# Altium project fmuvxX-baseT1.PrjPCB (part 2 of 2)

## Sheet 07_power_input.SchDoc: =Proj_Title
size B; Date: 05/11/2022; CheckedBy: David Sidrane; Author: Dugan Yoon; Organization: © 2022 NXP; Address1: Giesshuebelstrasse 40; Address2: 8045 Zurich, Switzerland; DocumentNumber: 725001; Revision: 01; SheetNumber: 7; SheetTotal: 11
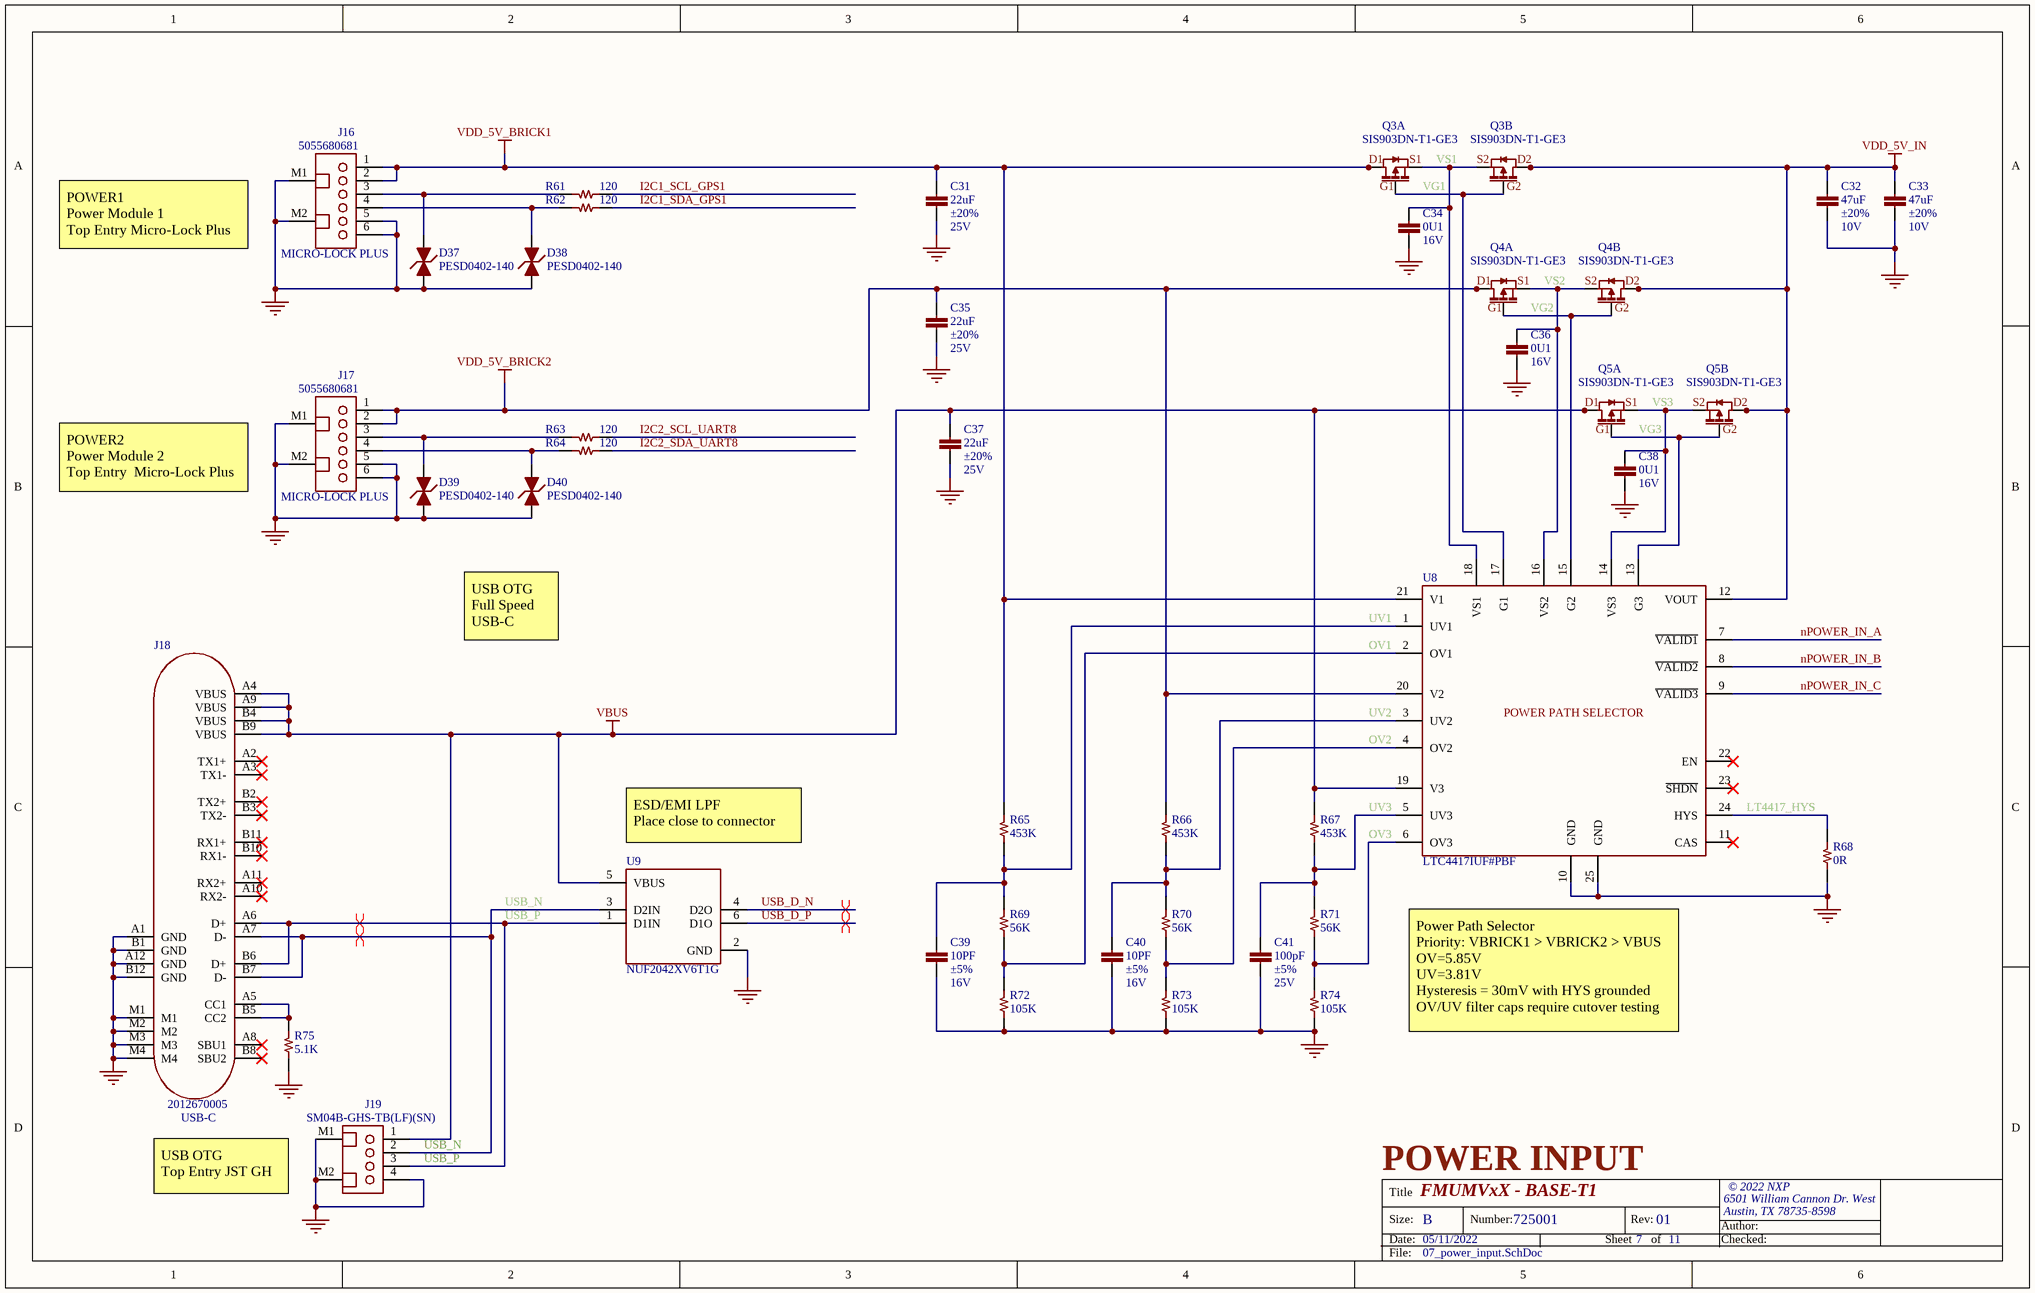
[diagram p2: 07_power_input.SchDoc]

### Parts
C31  value 22uF  Tolerance: ±20%  Voltage - Rated: 25V  [CAPC200X125X70L40N]  (hidden comment: CAP CER 22UF 20% 25V X5R 0805)
C32  value 47uF  Tolerance: ±20%  Voltage - Rated: 10V  [CAPC200X125X145L45N]  (hidden comment: CAP CER 47UF 20% 10V X5R 0805)
C33  value 47uF  Tolerance: ±20%  Voltage - Rated: 10V  [CAPC200X125X145L45N]  (hidden comment: CAP CER 47UF 20% 10V X5R 0805)
C34  value 0U1  Voltage - Rated: 16V  [CAPC100X50X56L25N]  (hidden comment: CAP CER 0.1UF 10% 16V X7R 0402)
C35  value 22uF  Tolerance: ±20%  Voltage - Rated: 25V  [CAPC200X125X70L40N]  (hidden comment: CAP CER 22UF 20% 25V X5R 0805)
C36  value 0U1  Voltage - Rated: 16V  [CAPC100X50X56L25N]  (hidden comment: CAP CER 0.1UF 10% 16V X7R 0402)
C37  value 22uF  Tolerance: ±20%  Voltage - Rated: 25V  [CAPC200X125X70L40N]  (hidden comment: CAP CER 22UF 20% 25V X5R 0805)
C38  value 0U1  Voltage - Rated: 16V  [CAPC100X50X56L25N]  (hidden comment: CAP CER 0.1UF 10% 16V X7R 0402)
C39  value 10PF  Tolerance: ±5%  Voltage - Rated: 16V  [CAPC100X50X56L25N]  (hidden comment: CAP CER 10PF 5% 16V C0G/NP0 0402)
C40  value 10PF  Tolerance: ±5%  Voltage - Rated: 16V  [CAPC100X50X56L25N]  (hidden comment: CAP CER 10PF 5% 16V C0G/NP0 0402)
C41  value 100pF  Tolerance: ±5%  Voltage - Rated: 25V  [CAPC100X50X56L25N]  (hidden comment: CAP CER 100PF 5% 25V COG/NPO 0402)
D37  Manufacturer Part Number: PESD0402-140  [DIONC100X50X43L20N]  (hidden comment: DIODE TVS BIDIRECTIONAL 14VWM 40VC 0402)
D38  Manufacturer Part Number: PESD0402-140  [DIONC100X50X43L20N]  (hidden comment: DIODE TVS BIDIRECTIONAL 14VWM 40VC 0402)
D39  Manufacturer Part Number: PESD0402-140  [DIONC100X50X43L20N]  (hidden comment: DIODE TVS BIDIRECTIONAL 14VWM 40VC 0402)
D40  Manufacturer Part Number: PESD0402-140  [DIONC100X50X43L20N]  (hidden comment: DIODE TVS BIDIRECTIONAL 14VWM 40VC 0402)
J16  ID: MICRO-LOCK PLUS  Manufacturer Part Number: 5055680681  [MOLEX_505568-0681]  (hidden comment: CONN HEADER MICRO-LOCK PLUS TOP 6POS 1.25MM SMT)
J17  ID: MICRO-LOCK PLUS  Manufacturer Part Number: 5055680681  [MOLEX_505568-0681]  (hidden comment: CONN HEADER MICRO-LOCK PLUS TOP 6POS 1.25MM SMT)
J18  ID: USB-C  Manufacturer Part Number: 2012670005  [MOLEX_2012670005]  (hidden comment: CONN RCPT USB C 3.1 SMT R/A SMD)
J19  Manufacturer Part Number: SM04B-GHS-TB(LF)(SN)  [JST_SM04B-GHS-TBLFSN]  (hidden comment: CONN HEADER GH SIDE 4POS 1.25MM SMT)
Q3  Manufacturer Part Number: SIS903DN-T1-GE3  [VISHAY_POWERPAK_1212-8_DUAL]  (hidden comment: TRAN MOSFET 2P-CH 20V 6A PowerPAK)  (parts A,B of 2)
Q4  Manufacturer Part Number: SIS903DN-T1-GE3  [VISHAY_POWERPAK_1212-8_DUAL]  (hidden comment: TRAN MOSFET 2P-CH 20V 6A PowerPAK)  (parts A,B of 2)
Q5  Manufacturer Part Number: SIS903DN-T1-GE3  [VISHAY_POWERPAK_1212-8_DUAL]  (hidden comment: TRAN MOSFET 2P-CH 20V 6A PowerPAK)  (parts A,B of 2)
R61  value 120  [RESC100X50X40L25]  (hidden comment: RES SMD 120 OHM 1% 1/16W 0402)
R62  value 120  [RESC100X50X40L25]  (hidden comment: RES SMD 120 OHM 1% 1/16W 0402)
R63  value 120  [RESC100X50X40L25]  (hidden comment: RES SMD 120 OHM 1% 1/16W 0402)
R64  value 120  [RESC100X50X40L25]  (hidden comment: RES SMD 120 OHM 1% 1/16W 0402)
R65  value 453K  [RESC100X50X40L25]  (hidden comment: RES SMD 453K OHM 1% 1/16W 0402)
R66  value 453K  [RESC100X50X40L25]  (hidden comment: RES SMD 453K OHM 1% 1/16W 0402)
R67  value 453K  [RESC100X50X40L25]  (hidden comment: RES SMD 453K OHM 1% 1/16W 0402)
R68  value 0R  [RESC100X50X40L25]  (hidden comment: RES SMD 0 OHM 1% 1/16W 0402)
R69  value 56K  [RESC100X50X40L25]  (hidden comment: RES SMD 56K OHM 1% 1/16W 0402)
R70  value 56K  [RESC100X50X40L25]  (hidden comment: RES SMD 56K OHM 1% 1/16W 0402)
R71  value 56K  [RESC100X50X40L25]  (hidden comment: RES SMD 56K OHM 1% 1/16W 0402)
R72  value 105K  [RESC100X50X40L25]  (hidden comment: RES SMD 105K OHM 1% 1/16W 0402)
R73  value 105K  [RESC100X50X40L25]  (hidden comment: RES SMD 105K OHM 1% 1/16W 0402)
R74  value 105K  [RESC100X50X40L25]  (hidden comment: RES SMD 105K OHM 1% 1/16W 0402)
R75  value 5.1K  [RESC100X50X40L25]  (hidden comment: RES SMD 5.1K OHM 1% 1/16W 0402)
U8  Manufacturer Part Number: LTC4417IUF#PBF  [QFN25P50_400X400X80L40X25T245N]  (hidden comment: IC OR CTRLR SRC SELECT 24QFN)
U9  Manufacturer Part Number: NUF2042XV6T1G  [SOFL6P50_160X160X60L20X22]  (hidden comment: IC FILTER RC(PI) 22 OHM/42PF SOT-563)

### Nets
GND: C31.2 C32.2 C33.2 C34.2 C35.2 C36.2 C37.2 C38.2 C39.2 C40.2 C41.2 D37.1 D38.1 D39.1 D40.1 J16.5 J16.6 J16.M1 J16.M2 J17.5 J17.6 J17.M1 J17.M2 J18.A1(GND) J18.A12(GND) J18.B1(GND) J18.B12(GND) J18.M1 J18.M2 J18.M3 J18.M4 J19.4 J19.M1 J19.M2 R68.2 R72.2 R73.2 R74.2 R75.2 U8.10(GND) U8.25(GND) U9.2(GND)
VBUS: C37.1 J18.A4(VBUS) J18.A9(VBUS) J18.B4(VBUS) J18.B9(VBUS) J19.1 Q5.7(D1) Q5.8(D1) R67.1 U8.19(V3) U9.5(VBUS)
VDD_5V_BRICK1: C31.1 J16.1 J16.2 Q3.7(D1) Q3.8(D1) R65.1 U8.21(V1)
VDD_5V_BRICK2: C35.1 J17.1 J17.2 Q4.7(D1) Q4.8(D1) R66.1 U8.20(V2)
VDD_5V_IN: C32.1 C33.1 Q3.5(D2) Q3.6(D2) Q4.5(D2) Q4.6(D2) Q5.5(D2) Q5.6(D2) U8.12(VOUT)
I2C1_SCL_GPS1: R61.2
I2C1_SDA_GPS1: R62.2
I2C2_SCL_UART8: R63.2
I2C2_SDA_UART8: R64.2
LT4417_HYS: R68.1 U8.24(HYS)
nPOWER_IN_A: U8.7(~{VALID1})
nPOWER_IN_B: U8.8(~{VALID2})
nPOWER_IN_C: U8.9(~{VALID3})
OV1: R69.2 R72.1 U8.2(OV1)
OV2: R70.2 R73.1 U8.4(OV2)
OV3: R71.2 R74.1 U8.6(OV3)
USB_D_N: U9.4(D2O)
USB_D_P: U9.6(D1O)
USB_N: J18.A7(D-) J18.B7(D-) J19.2 U9.3(D2IN)
USB_P: J18.A6(D+) J18.B6(D+) J19.3 U9.1(D1IN)
UV1: C39.1 R65.2 R69.1 U8.1(UV1)
UV2: C40.1 R66.2 R70.1 U8.3(UV2)
UV3: C41.1 R67.2 R71.1 U8.5(UV3)
VG1: Q3.2(G1) Q3.4(G2) U8.17(G1)
VG2: Q4.2(G1) Q4.4(G2) U8.15(G2)
VG3: Q5.2(G1) Q5.4(G2) U8.13(G3)
VS1: C34.1 Q3.1(S1) Q3.3(S2) U8.18(VS1)
VS2: C36.1 Q4.1(S1) Q4.3(S2) U8.16(VS2)
VS3: C38.1 Q5.1(S1) Q5.3(S2) U8.14(VS3)
NetD37_2: D37.2 J16.3 R61.1
NetD38_2: D38.2 J16.4 R62.1
NetD39_2: D39.2 J17.3 R63.1
NetD40_2: D40.2 J17.4 R64.1
NetJ18_A5: J18.A5(CC1) J18.B5(CC2) R75.1

Not connected (* = marked no-connect by the designer): J18 A2(TX1+)* A3(TX1-)* A8(SBU1)* A10(RX2-)* A11(RX2+)* B2(TX2+)* B3(TX2-)* B8(SBU2)* B10(RX1-)* B11(RX1+)*; U8 11(CAS)* 22(EN)* 23(~{SHDN})*

### Layout directives
differential pair: USB_D_N, USB_D_P, USB_N, USB_P

### Notes on the sheet
- POWER1
  Power Module 1
  Top Entry Micro-Lock Plus
- POWER2
  Power Module 2
  Top Entry  Micro-Lock Plus
- USB OTG
  Full Speed
  USB-C
- (near U9) ESD/EMI LPF
  Place close to connector
- (near U8) Power Path Selector
  Priority: VBRICK1 > VBRICK2 > VBUS
  OV=5.85V
  UV=3.81V
  Hysteresis = 30mV with HYS grounded
  OV/UV filter caps require cutover testing
- POWER INPUT
- USB OTG
  Top Entry JST GH
- Title
- Size:
- Date:
- B
- Number:
- Sheet
- Rev:
- of
- Author:
- Checked:
- File:
- (in symbol IC_LTC4417) POWER PATH SELECTOR

### Library data of the parts
C31 C35 C37 = CAP_22UF_20%_25V_X5R_0805: Manufacturer: Murata Electronics; Manufacturer Part Number: GRT21BR61E226ME13L; Packaging: Cut Tape (CT); Part Status: Active; Operating Temperature: -55°C ~ 125°C; Supplier 1: Digi-Key; Supplier Part Number 1: 490-12389-1-ND; Category: Capacitors; Stock 1: 0; Pricing 1: 1=0.58 (USD); ComponentLink1Description: https://www.digikey.com/en/products/detail/murata-electronics/GRT21BR61E226ME13L/5416811; ComponentLink1URL: https://www.digikey.com/en/products/detail/murata-electronics/GRT21BR61E226ME13L/5416811
C32 C33 = CAP_47UF_20%_10V_X5R_0805: Manufacturer: Murata Electronics North America; Manufacturer Part Number: GRM21BR61A476ME15L; Packaging: Cut Tape (CT); Part Status: Active; Operating Temperature: -55°C ~ 85°C; Supplier 1: Digi-Key; Supplier Part Number 1: 490-9961-1-ND; Category: Capacitors; Stock 1: 4315932; Pricing 1: 1=0.75 (USD); ComponentLink1Description: https://www.digikey.com/product-detail/en/murata-electronics-north-america/GRM21BR61A476ME15L/490-9961-1-ND/5026442; ComponentLink1URL: https://www.digikey.com/product-detail/en/murata-electronics-north-america/GRM21BR61A476ME15L/490-9961-1-ND/5026442
C34 C36 C38 = CAP_0U1_16V_X7R_0402: Manufacturer: Murata Electronics; Manufacturer Part Number: GCM155R71C104KA55J; Packaging: Cut Tape (CT); Part Status: Active; Tolerance: ±10%; Operating Temperature: -55°C ~ 125°C; Supplier 1: Digi-Key; Supplier Part Number 1: 490-7998-1-ND; Category: Capacitors; Stock 1: 6381653; Pricing 1: 1=0.1, 10=0.049, 100=0.022, 500=0.0157, 1000=0.01233, 2500=0.01121, 5000=0.01032 (USD); ComponentLink1Description: https://www.digikey.com/product-detail/en/murata-electronics/GCM155R71C104KA55J/490-7998-1-ND/4380283; ComponentLink1URL: https://www.digikey.com/product-detail/en/murata-electronics/GCM155R71C104KA55J/490-7998-1-ND/4380283
C39 C40 = CAP_10PF_5%_16V_NPO_0402: Manufacturer: Wurth Electronics Inc.; Manufacturer Part Number: 885012005025; Temperature Coefficient: C0G, NP0; Packaging: Cut Tape (CT); Part Status: Active; Operating Temperature: -55°C ~ 125°C; Supplier 1: Digi-Key; Supplier Part Number 1: 732-7441-1-ND; Category: Capacitors; Stock 1: 79611; Pricing 1: 1=0.1, 10=0.032, 100=0.0143, 500=0.0102, 1000=0.00802, 2500=0.00729, 5000=0.0067 (USD); ComponentLink1Description: https://www.digikey.com/product-detail/en/wurth-electronics-inc/885012005025/732-7441-1-ND/5454068; ComponentLink1URL: https://www.digikey.com/product-detail/en/wurth-electronics-inc/885012005025/732-7441-1-ND/5454068
C41 = CAP_100PF_5%_25V_NPO_0402: Manufacturer: KEMET; Manufacturer Part Number: C0402C101J3GACTU; Packaging: Cut Tape (CT); Part Status: Active; Operating Temperature: -55°C ~ 125°C; Supplier 1: Digi-Key; Supplier Part Number 1: 399-1022-1-ND; Category: Capacitors; Stock 1: 300; Pricing 1: 1=0.1, 10=0.02, 100=0.0091, 500=0.0065, 1000=0.00511, 2500=0.00465, 5000=0.00428 (USD); ComponentLink1Description: https://www.digikey.com/product-detail/en/kemet/C0402C101J3GACTU/399-1022-1-ND/411297; ComponentLink1URL: https://www.digikey.com/product-detail/en/kemet/C0402C101J3GACTU/399-1022-1-ND/411297
D37-D40 = DIODE_TVS_0402: Manufacturer: Littelfuse Inc.; Packaging: Cut Tape (CT); Part Status: Active; Operating Temperature: -55°C ~ 125°C (TJ); ComponentLink1URL: https://www.digikey.com/products/en/circuit-protection/tvs-diodes/144?k=PESD0402-140&k=&pkeyword=PESD0402-140&pv7=2&sf=0&quantity=&ColumnSort=0&page=1&pageSize=25; ComponentLink1Description: https://www.digikey.com/products/en/circuit-protection/tvs-diodes/144?k=PESD0402-140&k=&pkeyword=PESD0402-140&pv7=2&sf=0&quantity=&ColumnSort=0&page=1&pageSize=25; Supplier 1: Digi-Key; Supplier Part Number 1: PESD0402-140CT-ND; Category: Circuit Protection; Stock 1: 281442; Pricing 1: 10000=0.13154, 30000=0.12096 (USD)
J16 J17 = CONN_HDR_1X6_RCPT_1.25MM_VERT_SMT: Manufacturer: Molex, LLC; Voltage - Rated: 50V; System: Connector; Packaging: Cut Tape (CT); Part Status: Active; Operating Temperature: -40°C ~ 105°C; Supplier 1: Digi-Key; Supplier Part Number 1: WM26835CT-ND; Category: Connectors, Interconnects; Stock 1: 4793; Pricing 1: 1=1.05 (USD); ComponentLink1Description: https://www.digikey.com/products/en/connectors-interconnects/rectangular-connectors-headers-male-pins/314?k=5055680681&k=&pkeyword=5055680681&sv=0&pv7=2&sf=0&quantity=&ColumnSort=0&page=1&pageSize=25; ComponentLink1URL: https://www.digikey.com/products/en/connectors-interconnects/rectangular-connectors-headers-male-pins/314?k=5055680681&k=&pkeyword=5055680681&sv=0&pv7=2&sf=0&quantity=&ColumnSort=0&page=1&pageSize=25
J18 = CONN_RCPT_24POS_USB-C_RA-3_SMD: Manufacturer: Molex, LLC; Voltage - Rated: 30VAC/DC; System: Connector; Packaging: Cut Tape (CT); Part Status: Active; Operating Temperature: -40°C ~ 105°C; Supplier 1: Digi-Key; Supplier Part Number 1: WM17992CT-ND; Category: Connectors, Interconnects; Stock 1: 58789; Pricing 1: 1=2.58 (USD); ComponentLink1Description: https://www.digikey.com/product-detail/en/molex/2012670005/WM17992CT-ND/8593492; ComponentLink1URL: https://www.digikey.com/product-detail/en/molex/2012670005/WM17992CT-ND/8593492
J19 = CONN_JST_GH_4PIN_RA_SMT: Manufacturer: JST Sales America Inc.; Voltage Rating: 50V; System: Connector; Packaging: Cut Tape (CT); Part Status: Active; Operating Temperature: -25°C ~ 85°C; Supplier 1: Digi-Key; Supplier Part Number 1: 455-1566-1-ND; Category: Connectors, Interconnects; Stock 1: 109892; Pricing 1: 1=0.45, 10=0.423, 100=0.3244, 500=0.28212, 1000=0.23274 (USD); ComponentLink1Description: https://www.digikey.com/products/en/connectors-interconnects/rectangular-connectors-headers-male-pins/314?k=SM04B-GHS-TB%28LF%29%28SN%29-&k=&pkeyword=SM04B-GHS-TB%28LF%29%28SN%29-&pv7=2&sf=0&quantity=&ColumnSort=0&page=1&pageSize=25; ComponentLink1URL: https://www.digikey.com/products/en/connectors-interconnects/rectangular-connectors-headers-male-pins/314?k=SM04B-GHS-TB%28LF%29%28SN%29-&k=&pkeyword=SM04B-GHS-TB%28LF%29%28SN%29-&pv7=2&sf=0&quantity=&ColumnSort=0&page=1&pageSize=25
Q3-Q5 = TRAN_MOSFET_DUAL_PCHANNEL_PowerPAK: Manufacturer: Vishay Siliconix; RoHS: RoHS Compliant; Packaging: Cut Tape (CT); Part Status: Active; Drain to Source Voltage (Vdss): 20V; Current - Continuous Drain (Id) @ 25°C: 6A; Operating Temperature: -55°C ~ 150°C (TJ); Supplier 1: Digi-Key; Supplier Part Number 1: SIS903DN-T1-GE3CT-ND; Category: Discrete Semiconductor Products; Stock 1: 0; Pricing 1: 1=1.01 (USD); ComponentLink1Description: https://www.digikey.com/products/en/discrete-semiconductor-products/transistors-fets-mosfets-arrays/289?k=sis903dn&k=&pkeyword=sis903dn&sv=0&pv7=2&sf=0&quantity=&ColumnSort=0&page=1&pageSize=25; ComponentLink1URL: https://www.digikey.com/products/en/discrete-semiconductor-products/transistors-fets-mosfets-arrays/289?k=sis903dn&k=&pkeyword=sis903dn&sv=0&pv7=2&sf=0&quantity=&ColumnSort=0&page=1&pageSize=25
R61-R64 = RES_120_1%_1/16W_0402: Manufacturer: Yageo; Manufacturer Part Number: RC0402FR-07120RL; Category: Resistors; Packaging: Cut Tape (CT); Part Status: Active; Tolerance: ±1%; Operating Temperature: -55°C ~ 155°C; Supplier 1: Digi-Key; Supplier Part Number 1: 311-120LRCT-ND; Stock 1: 607269; Pricing 1: 1=0.1, 10=0.014, 100=0.0056, 1000=0.00253, 2500=0.0022, 5000=0.00181 (USD); Power: 1/16W; ComponentLink1Description: https://www.digikey.com/products/en/resistors/chip-resistor-surface-mount/52?k=RC0402FR-07120RL&k=&pkeyword=RC0402FR-07120RL&pv7=2&sf=0&quantity=&ColumnSort=0&page=1&pageSize=25; ComponentLink1URL: https://www.digikey.com/products/en/resistors/chip-resistor-surface-mount/52?k=RC0402FR-07120RL&k=&pkeyword=RC0402FR-07120RL&pv7=2&sf=0&quantity=&ColumnSort=0&page=1&pageSize=25
R65-R67 = RES_453K_1%_1/16W_0402: Manufacturer: Yageo; Manufacturer Part Number: RC0402FR-07453KL; Packaging: Cut Tape (CT); Part Status: Active; Tolerance: ±1%; Operating Temperature: -55°C ~ 155°C; Supplier 1: Digi-Key; Supplier Part Number 1: YAG3164CT-ND; Category: Resistors; Stock 1: 1103957; Pricing 1: 1=0.1, 10=0.014, 100=0.0056, 1000=0.00253, 2500=0.0022, 5000=0.00181 (USD); Power: 1/16W; ComponentLink1Description: https://www.digikey.com/products/en/resistors/chip-resistor-surface-mount/52?k=&pkeyword=&pv2085=u453+kOhms&pv2=1&sf=0&FV=fffc000d%2C1c0002%2C1f140000%2Cffe00034%2Cc0001%2C2b80016&quantity=&ColumnSort=0&page=1&pageSize=25; ComponentLink1URL: https://www.digikey.com/products/en/resistors/chip-resistor-surface-mount/52?k=&pkeyword=&pv2085=u453+kOhms&pv2=1&sf=0&FV=fffc000d%2C1c0002%2C1f140000%2Cffe00034%2Cc0001%2C2b80016&quantity=&ColumnSort=0&page=1&pageSize=25
R68 = RES_0R_1%_1/16W_0402: Manufacturer: Yageo; Manufacturer Part Number: RC0402JR-070RL; Packaging: Cut Tape (CT); Part Status: Active; Tolerance: ±1%; Operating Temperature: -55°C ~ 155°C; Supplier 1: Digi-Key; Supplier Part Number 1: 311-0.0JRCT-ND; Category: Resistors; Stock 1: 34962204; Pricing 1: 1=0.1, 10=0.014, 100=0.0056, 1000=0.00253, 2500=0.0022, 5000=0.00181 (USD); Power: 1/16W; ComponentLink1Description: https://www.digikey.com/product-detail/en/yageo/RC0402JR-070RL/311-0.0JRCT-ND/729353; ComponentLink1URL: https://www.digikey.com/product-detail/en/yageo/RC0402JR-070RL/311-0.0JRCT-ND/729353
R69-R71 = RES_56K_1%_1/16W_0402: Manufacturer: Yageo; Manufacturer Part Number: AC0402FR-0756KL; Packaging: Cut Tape (CT); Part Status: Active; Tolerance: ±1%; Operating Temperature: -55°C ~ 155°C; Supplier 1: Digi-Key; Supplier Part Number 1: YAG3501CT-ND; Category: Resistors; Stock 1: 261; Pricing 1: 1=0.1, 10=0.014, 100=0.0056, 1000=0.00253, 2500=0.0022, 5000=0.00181 (USD); Power: 1/16W; ComponentLink1Description: https://www.digikey.com/product-detail/en/yageo/AC0402FR-0756KL/YAG3501CT-ND/6006350; ComponentLink1URL: https://www.digikey.com/product-detail/en/yageo/AC0402FR-0756KL/YAG3501CT-ND/6006350
R72-R74 = RES_105K_1%_1/16W_0402: Manufacturer: Yageo; Manufacturer Part Number: RC0402FR-07105KL; Packaging: Cut Tape (CT); Part Status: Active; Tolerance: ±1%; Operating Temperature: -55°C ~ 155°C; Supplier 1: Digi-Key; Supplier Part Number 1: YAG2946CT-ND; Category: Resistors; Stock 1: 1079008; Pricing 1: 1=0.1, 10=0.014, 100=0.0056, 1000=0.00253, 2500=0.0022, 5000=0.00181 (USD); Power: 1/16W; ComponentLink1Description: https://www.digikey.com/product-detail/en/yageo/RC0402FR-07105KL/YAG2946CT-ND/5281811; ComponentLink1URL: https://www.digikey.com/product-detail/en/yageo/RC0402FR-07105KL/YAG2946CT-ND/5281811
R75 = RES_5.1K_1%_1/16W_0402: Manufacturer: Yageo; Manufacturer Part Number: RC0402FR-075K1L; Packaging: Cut Tape (CT); Part Status: Active; Tolerance: ±1%; Operating Temperature: -55°C ~ 155°C; Supplier 1: Digi-Key; Supplier Part Number 1: 311-5.10KLRCT-ND; Category: Resistors; Stock 1: 4559073; Pricing 1: 1=0.1, 10=0.014, 100=0.0056, 1000=0.00253, 2500=0.0022, 5000=0.00181 (USD); Power: 1/16W; ComponentLink1Description: https://www.digikey.com/product-detail/en/yageo/RC0402FR-075K1L/311-5.10KLRCT-ND/729571; ComponentLink1URL: https://www.digikey.com/product-detail/en/yageo/RC0402FR-075K1L/311-5.10KLRCT-ND/729571
U8 = IC_LTC4417: Manufacturer: Linear Technology/Analog Devices; FET Type: P-Channel; Ratio - Input:Output: 3:1; Current - Supply: 28µA; Voltage - Supply: 2.5 V ~ 36 V; RoHS: RoHS Compliant; Packaging: Tube; Part Status: Active; Type: Source Selector Switch; Current - Output (Max): -; Applications: Battery Backup, Handheld/Mobile Devices; Operating Temperature: -40°C ~ 85°C; Mounting Type: Surface Mount; Package / Case: 24-WFQFN Exposed Pad; Supplier Device Package: 24-QFN (4x4); Supplier 1: Digi-Key; Supplier Part Number 1: LTC4417IUF#PBF-ND; Category: Integrated Circuits (ICs); Stock 1: 7448; Pricing 1: 1=8.73 (USD); ComponentLink1Description: https://www.digikey.com/product-detail/en/linear-technology-analog-devices/LTC4417IUF-PBF/LTC4417IUF-PBF-ND/3838535; ComponentLink1URL: https://www.digikey.com/product-detail/en/linear-technology-analog-devices/LTC4417IUF-PBF/LTC4417IUF-PBF-ND/3838535
U9 = IC_NUF2042XV6_SOT563: Manufacturer: ON Semiconductor; Packaging: Cut Tape (CT); Part Status: Active; Operating Temperature: -55°C ~ 125°C; Voltage - Rated: -; ComponentLink1URL: https://www.digikey.com/products/en/filters/emi-rfi-filters-lc-rc-networks/835?k=nuf2042xv6&k=&pkeyword=nuf2042xv6&pv7=2&pv1989=0&sf=0&quantity=&ColumnSort=0&page=1&pageSize=25; ComponentLink1Description: https://www.digikey.com/products/en/filters/emi-rfi-filters-lc-rc-networks/835?k=nuf2042xv6&k=&pkeyword=nuf2042xv6&pv7=2&pv1989=0&sf=0&quantity=&ColumnSort=0&page=1&pageSize=25; Supplier 1: Digi-Key; Supplier Part Number 1: NUF2042XV6T1GOSCT-ND; Category: Filters; Stock 1: 4900; Pricing 1: 1=0.31, 10=0.286, 25=0.2728, 50=0.264, 100=0.2552, 250=0.242, 500=0.2024, 1000=0.15708 (USD)

## Sheet 11_sensors.SchDoc: =Proj_Title
size B; Date: 05/11/2022; CheckedBy: David Sidrane; Author: Dugan Yoon; Organization: © 2022 NXP; Address1: Giesshuebelstrasse 40; Address2: 8045 Zurich, Switzerland; DocumentNumber: 725001; Revision: 01; SheetNumber: 11; SheetTotal: 11
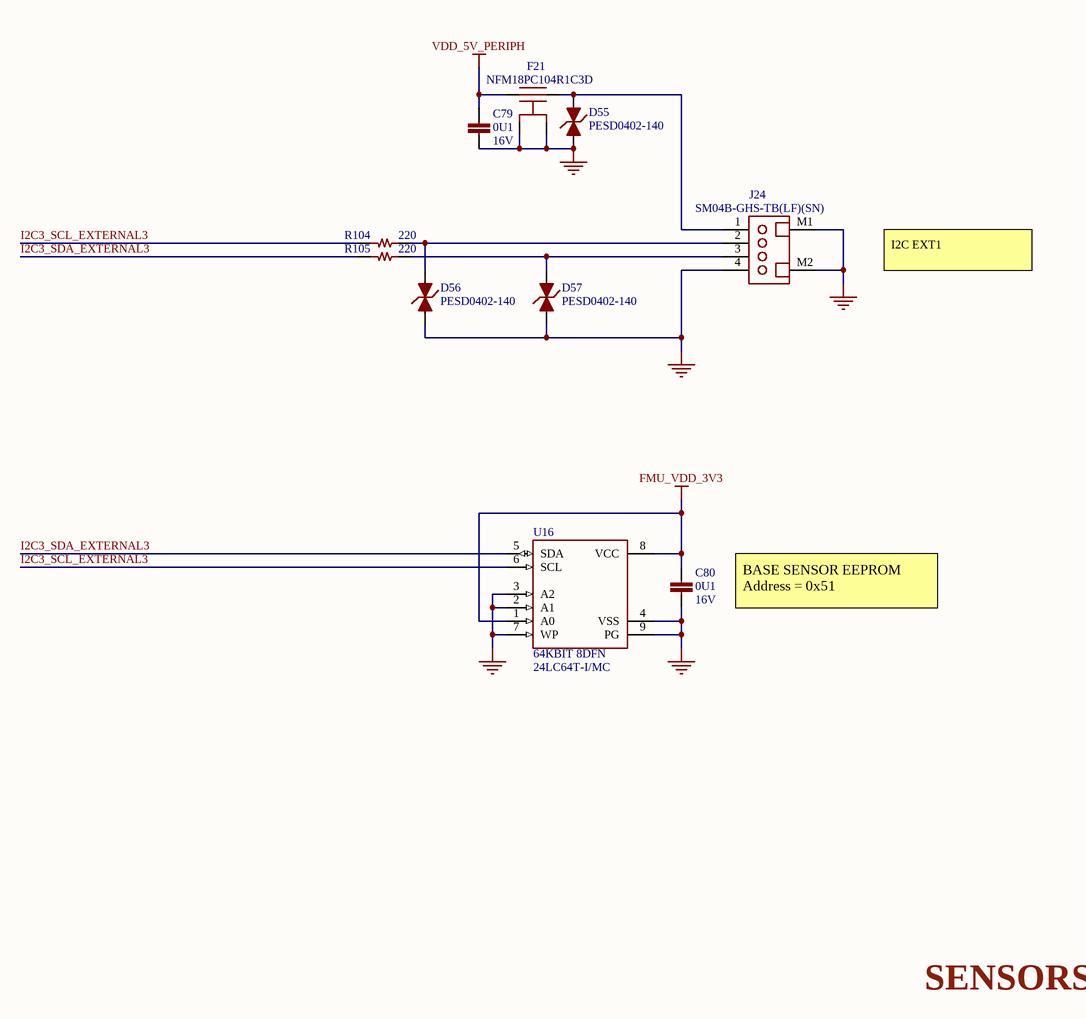
[diagram p3: 11_sensors.SchDoc]

### Parts
C79  value 0U1  Voltage - Rated: 16V  [CAPC100X50X56L25N]  (hidden comment: CAP CER 0.1UF 10% 16V X7R 0402)
C80  value 0U1  Voltage - Rated: 16V  [CAPC100X50X56L25N]  (hidden comment: CAP CER 0.1UF 10% 16V X7R 0402)
D55  Manufacturer Part Number: PESD0402-140  [DIONC100X50X43L20N]  (hidden comment: DIODE TVS BIDIRECTIONAL 14VWM 40VC 0402)
D56  Manufacturer Part Number: PESD0402-140  [DIONC100X50X43L20N]  (hidden comment: DIODE TVS BIDIRECTIONAL 14VWM 40VC 0402)
D57  Manufacturer Part Number: PESD0402-140  [DIONC100X50X43L20N]  (hidden comment: DIODE TVS BIDIRECTIONAL 14VWM 40VC 0402)
F21  Manufacturer Part Number: NFM18PC104R1C3D  [NFM18PC104R1C3_0603_NO_VIA]  (hidden comment: FILTER CAP FEEDTHRU 0.1UF 20% 16V 0603)
J24  Manufacturer Part Number: SM04B-GHS-TB(LF)(SN)  [JST_SM04B-GHS-TBLFSN]  (hidden comment: CONN HEADER GH SIDE 4POS 1.25MM SMT)
R104  value 220  [RESC100X50X40L25]  (hidden comment: RES SMD 220 OHM 1% 1/16W 0402)
R105  value 220  [RESC100X50X40L25]  (hidden comment: RES SMD 220 OHM 1% 1/16W 0402)
U16  ID: 64KBIT 8DFN  Manufacturer Part Number: 24LC64T-I/MC  [SON9P50_200X300X100L40X25T153X170N]  (hidden comment: IC EEPROM 64K I2C 400KHZ 8DFN)

### Nets
FMU_VDD_3V3: C80.1 U16.1(A0) U16.8(VCC)
GND: C79.2 C80.2 D55.1 D56.1 D57.1 F21.2A(GND) F21.2B(GND) J24.4 J24.M1 J24.M2 U16.2(A1) U16.3(A2) U16.4(VSS) U16.7(WP) U16.9(PG)
VDD_5V_PERIPH: C79.1 F21.1
I2C3_SCL_EXTERNAL3: R104.1 U16.6(SCL)
I2C3_SDA_EXTERNAL3: R105.1 U16.5(SDA)
NetD55_2: D55.2 F21.3 J24.1
NetD56_2: D56.2 J24.2 R104.2
NetD57_2: D57.2 J24.3 R105.2

### Notes on the sheet
- I2C EXT1
- BASE SENSOR EEPROM
  Address = 0x51
- SENSORS
- Title
- Size:
- Date:
- B
- Number:
- Sheet
- Rev:
- of
- Author:
- Checked:
- File:

### Library data of the parts
C79 C80 = CAP_0U1_16V_X7R_0402: as C34 on sheet 07_power_input; Packaging: Cut Tape (CT); Part Status: Active; Tolerance: ±10%; Operating Temperature: -55°C ~ 125°C; Supplier 1: Digi-Key; Supplier Part Number 1: 490-7998-1-ND; Category: Capacitors; Stock 1: 6381653; Pricing 1: 1=0.1, 10=0.049, 100=0.022, 500=0.0157, 1000=0.01233, 2500=0.01121, 5000=0.01032 (USD); ComponentLink1Description: https://www.digikey.com/product-detail/en/murata-electronics/GCM155R71C104KA55J/490-7998-1-ND/4380283; ComponentLink1URL: https://www.digikey.com/product-detail/en/murata-electronics/GCM155R71C104KA55J/490-7998-1-ND/4380283
D55-D57 = DIODE_TVS_0402: Manufacturer: Littelfuse Inc.; Packaging: Cut Tape (CT); Part Status: Active; Operating Temperature: -55°C ~ 125°C (TJ); ComponentLink1URL: https://www.digikey.com/products/en/circuit-protection/tvs-diodes/144?k=PESD0402-140&k=&pkeyword=PESD0402-140&pv7=2&sf=0&quantity=&ColumnSort=0&page=1&pageSize=25; ComponentLink1Description: https://www.digikey.com/products/en/circuit-protection/tvs-diodes/144?k=PESD0402-140&k=&pkeyword=PESD0402-140&pv7=2&sf=0&quantity=&ColumnSort=0&page=1&pageSize=25; Supplier 1: Digi-Key; Supplier Part Number 1: PESD0402-140CT-ND; Category: Circuit Protection; Stock 1: 281442; Pricing 1: 10000=0.13154, 30000=0.12096 (USD)
F21 = FILTER_0.1uF_16V_2A_NO_VIA_0603: Manufacturer: Murata Electronics North America; Packaging: Cut Tape (CT); Part Status: Active; Tolerance: ±20%; Voltage - Rated: 16V; Operating Temperature: -55°C ~ 125°C; Supplier 1: Digi-Key; Supplier Part Number 1: 490-6969-1-ND; Category: Filters; Stock 1: 172860; Pricing 1: 1=0.19, 10=0.173, 25=0.1652, 50=0.1598, 100=0.1544, 250=0.1464, 500=0.12246, 1000=0.09503 (USD); ComponentLink1Description: https://www.digikey.com/products/en/filters/feed-through-capacitors/845?k=NFM18PC104R1C3D&k=&pkeyword=NFM18PC104R1C3D&pv7=2&sf=0&quantity=&ColumnSort=0&page=1&pageSize=25; ComponentLink1URL: https://www.digikey.com/products/en/filters/feed-through-capacitors/845?k=NFM18PC104R1C3D&k=&pkeyword=NFM18PC104R1C3D&pv7=2&sf=0&quantity=&ColumnSort=0&page=1&pageSize=25
J24 = CONN_JST_GH_4PIN_RA_SMT: as J19 on sheet 07_power_input; Packaging: Cut Tape (CT); Part Status: Active; Operating Temperature: -25°C ~ 85°C; Supplier 1: Digi-Key; Supplier Part Number 1: 455-1566-1-ND; Category: Connectors, Interconnects; Stock 1: 109892; Pricing 1: 1=0.45, 10=0.423, 100=0.3244, 500=0.28212, 1000=0.23274 (USD); ComponentLink1Description: https://www.digikey.com/products/en/connectors-interconnects/rectangular-connectors-headers-male-pins/314?k=SM04B-GHS-TB%28LF%29%28SN%29-&k=&pkeyword=SM04B-GHS-TB%28LF%29%28SN%29-&pv7=2&sf=0&quantity=&ColumnSort=0&page=1&pageSize=25; ComponentLink1URL: https://www.digikey.com/products/en/connectors-interconnects/rectangular-connectors-headers-male-pins/314?k=SM04B-GHS-TB%28LF%29%28SN%29-&k=&pkeyword=SM04B-GHS-TB%28LF%29%28SN%29-&pv7=2&sf=0&quantity=&ColumnSort=0&page=1&pageSize=25
R104 R105 = RES_220_1%_1/16W_0402: Manufacturer: Yageo; Manufacturer Part Number: RC0402FR-07220RL; Category: Resistors; Packaging: Cut Tape (CT); Part Status: Active; Tolerance: ±1%; Power: 1/16W; Operating Temperature: -55°C ~ 155°C; ComponentLink1URL: https://www.digikey.com/products/en/resistors/chip-resistor-surface-mount/52?k=RC0402FR-07220RL&k=&pkeyword=RC0402FR-07220RL&pv7=2&sf=0&quantity=&ColumnSort=0&page=1&pageSize=25; ComponentLink1Description: https://www.digikey.com/products/en/resistors/chip-resistor-surface-mount/52?k=RC0402FR-07220RL&k=&pkeyword=RC0402FR-07220RL&pv7=2&sf=0&quantity=&ColumnSort=0&page=1&pageSize=25; Supplier 1: Digi-Key; Supplier Part Number 1: 311-220LRCT-ND; Stock 1: 897942; Pricing 1: 1=0.1, 10=0.014, 100=0.0056, 1000=0.00253, 2500=0.0022, 5000=0.00181 (USD)
U16 = IC_EEPROM_64K_I2C_8DFN: Manufacturer: Microchip Technology; Part Status: Active; Operating Temperature: -40°C ~ 85°C (TA); Supplier 1: Digi-Key; Supplier Part Number 1: 24LC64T-I/MCCT-ND; Category: Integrated Circuits (ICs); Stock 1: 2351; Pricing 1: 1=0.47 (USD); Packaging: Cut Tape (CT); ComponentLink1Description: https://www.digikey.com/products/en/integrated-circuits-ics/memory/774?k=&pkeyword=&sv=0&pv7=2&sf=0&FV=fffc0096&mpart=24LC64T-I%2FMC&quantity=&ColumnSort=0&page=1&pageSize=25; ComponentLink1URL: https://www.digikey.com/products/en/integrated-circuits-ics/memory/774?k=&pkeyword=&sv=0&pv7=2&sf=0&FV=fffc0096&mpart=24LC64T-I%2FMC&quantity=&ColumnSort=0&page=1&pageSize=25

## Nets that join several sheets
FMU_VDD_3V3: 04_uart_i2c (C13.1 F4.1), 06_rc_cap (5 pins), 11_sensors (C80.1 U16.1 U16.8)
GND: 04_uart_i2c (56 pins), 06_rc_cap (45 pins), 07_power_input (42 pins), 11_sensors (15 pins)
VBUS: 06_rc_cap (R46.1 U4.1), 07_power_input (11 pins)
VDD_5V_PERIPH: 04_uart_i2c (6 pins), 06_rc_cap (C27.1 F12.1), 11_sensors (C79.1 F21.1)
I2C1_SCL_GPS1: 04_uart_i2c (R18.1), 07_power_input (R61.2)
I2C1_SDA_GPS1: 04_uart_i2c (R19.1), 07_power_input (R62.2)
I2C2_SCL_UART8: 04_uart_i2c (R30.1), 07_power_input (R63.2)
I2C2_SDA_UART8: 04_uart_i2c (R31.1), 07_power_input (R64.2)
I2C3_SCL_EXTERNAL3: 04_uart_i2c (R34.1), 11_sensors (R104.1 U16.6)
I2C3_SDA_EXTERNAL3: 04_uart_i2c (R35.1), 11_sensors (R105.1 U16.5)

## Assembly variants
Production: not fitted C? C? C? C? C? C? C? C? C? C? R1 R1 R2 R2 R59 R? R? R? R? R? R? R? R? R?